# Altium schematic sheet Power.SchDoc: {Наименование}
size 420 x 297 mm; ApprovedBy: {Утвердил}; CheckedBy: {Проверил}; DrawnBy: {Разраб.}; DocumentNumber: НРДЦ.ХХХХХХ.ХХХ 00; SheetNumber: {}; SheetTotal: {}; Scale: {Мш.}; PageSetup: Record=PageOptions|CenterHorizontal=False|CenterVertical=False|PrintScale=0.95|XCorrection=0.00|YCorrection=0.00|PrintKind=1|BorderSize=5000000|LeftOffset=0|BottomOffset=0|Orientation=1|PaperLength=1000|PaperWidth=1000|Scale=100|PaperSource=15|PrintQuality=600|MediaType=1|DitherType=10|PaperKind=A4|PrintScaleMode=1; ProcessInspection: {Т.контр.}; Mass: {М.}; NormInspection: {Н.контр.}; Letter1Column: {}; Letter2Column: {}; Letter3Column: {}; DocumentType: {Документ}; Rule: PcbType=ProtelPcb
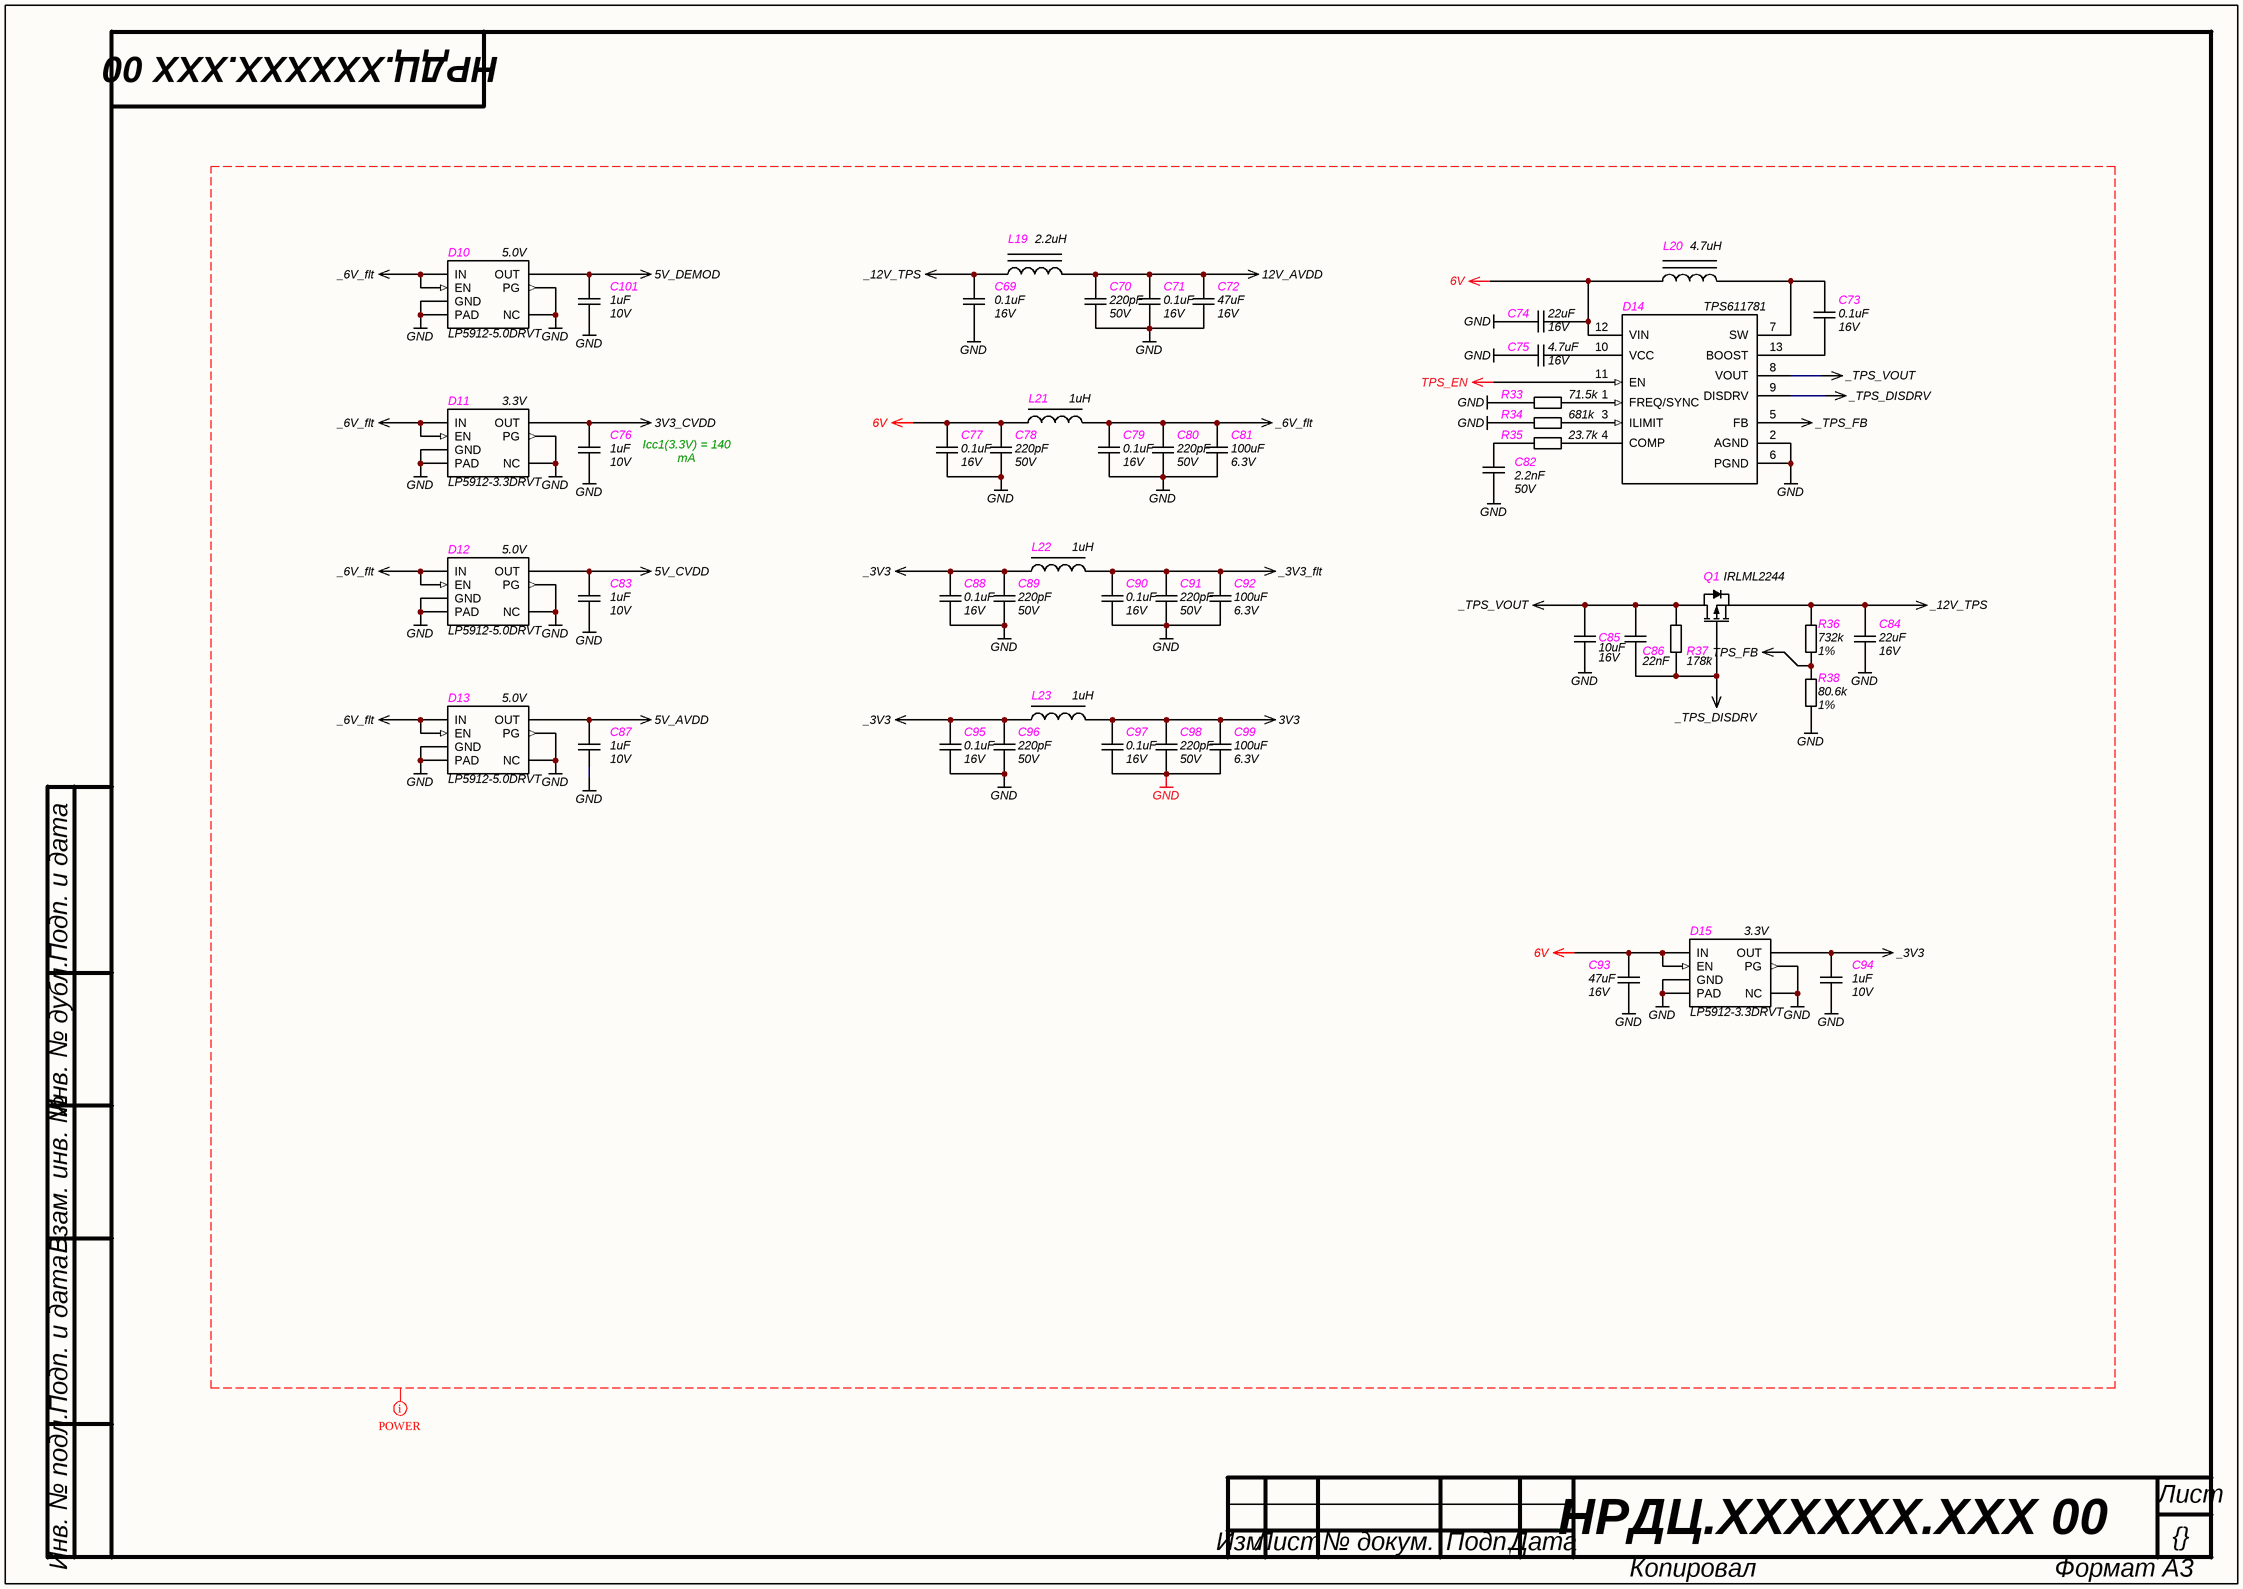
[diagram p0: Power.SchDoc]

## Parts
C69  value 0.1uF  Voltage: 16V  [C0402]  (hidden comment: CAP)
C70  value 220pF  Voltage: 50V  [C0603]  (hidden comment: CAP)
C71  value 0.1uF  Voltage: 16V  [C0402]  (hidden comment: CAP)
C72  value 47uF  Voltage: 16V  [C1210]  (hidden comment: CAP uF)
C73  value 0.1uF  Voltage: 16V  [C0402]  (hidden comment: CAP)
C74  value 22uF  Voltage: 16V  [C0805]  (hidden comment: CAP uF)
C75  value 4.7uF  Voltage: 16V  [C0603]  (hidden comment: CAP)
C76  value 1uF  Voltage: 10V  [C0805]  (hidden comment: CAP)
C77  value 0.1uF  Voltage: 16V  [C0402]  (hidden comment: CAP)
C78  value 220pF  Voltage: 50V  [C0603]  (hidden comment: CAP)
C79  value 0.1uF  Voltage: 16V  [C0402]  (hidden comment: CAP)
C80  value 220pF  Voltage: 50V  [C0603]  (hidden comment: CAP)
C81  value 100uF  Voltage: 6.3V  [C1210]  (hidden comment: CAP uF)
C82  value 2.2nF  Voltage: 50V  [C0603]  (hidden comment: CAP)
C83  value 1uF  Voltage: 10V  [C0805]  (hidden comment: CAP)
C84  value 22uF  Voltage: 16V  [C0805]  (hidden comment: CAP uF)
C85  value 10uF  Voltage: 16V  [C0805]  (hidden comment: CAP uF)
C86  value 22nF  [C0402]  (hidden comment: CAP)
C87  value 1uF  Voltage: 10V  [C0805]  (hidden comment: CAP)
C88  value 0.1uF  Voltage: 16V  [C0402]  (hidden comment: CAP)
C89  value 220pF  Voltage: 50V  [C0603]  (hidden comment: CAP)
C90  value 0.1uF  Voltage: 16V  [C0402]  (hidden comment: CAP)
C91  value 220pF  Voltage: 50V  [C0603]  (hidden comment: CAP)
C92  value 100uF  Voltage: 6.3V  [C1210]  (hidden comment: CAP uF)
C93  value 47uF  Voltage: 16V  [C1210]  (hidden comment: CAP uF)
C94  value 1uF  Voltage: 10V  [C0805]  (hidden comment: CAP)
C95  value 0.1uF  Voltage: 16V  [C0402]  (hidden comment: CAP)
C96  value 220pF  Voltage: 50V  [C0603]  (hidden comment: CAP)
C97  value 0.1uF  Voltage: 16V  [C0402]  (hidden comment: CAP)
C98  value 220pF  Voltage: 50V  [C0603]  (hidden comment: CAP)
C99  value 100uF  Voltage: 6.3V  [C1210]  (hidden comment: CAP uF)
C101  value 1uF  Voltage: 10V  [C0805]  (hidden comment: CAP)
D10  Name: LP5912-5.0DRVT  Voltage: 5.0V  [WSON-6]  (hidden comment: LP5912)
D11  Name: LP5912-3.3DRVT  Voltage: 3.3V  [WSON-6]  (hidden comment: LP5912)
D12  Name: LP5912-5.0DRVT  Voltage: 5.0V  [WSON-6]  (hidden comment: LP5912)
D13  Name: LP5912-5.0DRVT  Voltage: 5.0V  [WSON-6]  (hidden comment: LP5912)
D14  TPS611781  [TPS611781x]
D15  Name: LP5912-3.3DRVT  Voltage: 3.3V  [WSON-6]  (hidden comment: LP5912)
L19  value 2.2uH  [XAL4020]  (hidden comment: Inductor PWR)
L20  value 4.7uH  [XAL4030]  (hidden comment: Inductor PWR)
L21  value 1uH  [L1210_Murata LQH]  (hidden comment: Inductor LF)
L22  value 1uH  [L1210_Murata LQH]  (hidden comment: Inductor LF)
L23  value 1uH  [L1210_Murata LQH]  (hidden comment: Inductor LF)
Q1  IRLML2244  [SOT-23]
R33  value 71.5k  [R0402]  (hidden comment: RES)
R34  value 681k  [R0402]  (hidden comment: RES)
R35  value 23.7k  [R0603]  (hidden comment: RES)
R36  value 732k  Tolerance: 1%  [R0402]  (hidden comment: RES)
R37  value 178k  [R0402]  (hidden comment: RES)
R38  value 80.6k  Tolerance: 1%  [R0402]  (hidden comment: RES)

## Nets
3V3: C97.2 C98.2 C99.2 L23.2
3V3_CVDD: C76.1 D11.1(OUT)
5V_AVDD: C87.1 D13.1(OUT)
5V_CVDD: C83.1 D12.1(OUT)
5V_DEMOD: C101.1 D10.1(OUT)
6V: C74.1 C77.2 C78.2 C93.2 D14.12(VIN) D15.4(EN) D15.6(IN) L20.1 L21.1
12V_AVDD: C70.2 C71.2 C72.2 L19.2
_3V3: C88.2 C89.2 C94.1 C95.2 C96.2 D15.1(OUT) L22.1 L23.1
_3V3_flt: C90.2 C91.2 C92.2 L22.2
_6V_flt: C79.2 C80.2 C81.2 D10.4(EN) D10.6(IN) D11.4(EN) D11.6(IN) D12.4(EN) D12.6(IN) D13.4(EN) D13.6(IN) L21.2
_12V_TPS: C69.2 C84.2 L19.1 Q1.2(S) R36.2
_TPS_DISDRV: C86.2 D14.9(DISDRV) Q1.1(G) R37.1
_TPS_FB: D14.5(FB) R36.1 R38.2
_TPS_VOUT: C85.2 C86.1 D14.8(VOUT) Q1.3(D) R37.2
GND: C69.1 C70.1 C71.1 C72.1 C74.2 C75.2 C76.2 C77.1 C78.1 C79.1 C80.1 C81.1 C82.1 C83.2 C84.1 C85.1 C87.2 C88.1 C89.1 C90.1 C91.1 C92.1 C93.1 C94.2 C95.1 C96.1 C97.1 C98.1 C99.1 C101.2 D10.0(PAD) D10.2(NC) D10.3(PG) D10.5(GND) D11.0(PAD) D11.2(NC) D11.3(PG) D11.5(GND) D12.0(PAD) D12.2(NC) D12.3(PG) D12.5(GND) D13.0(PAD) D13.2(NC) D13.3(PG) D13.5(GND) D14.2(AGND) D14.6(PGND) D15.0(PAD) D15.2(NC) D15.3(PG) D15.5(GND) R33.1 R34.1 R38.1
TPS_EN: D14.11(EN)
NetC73_1: C73.1 D14.13(BOOST)
NetC73_2: C73.2 D14.7(SW) L20.2
NetC75_1: C75.1 D14.10(VCC)
NetC82_2: C82.2 R35.1
NetD14_1: D14.1(FREQ/SYNC) R33.2
NetD14_3: D14.3(ILIMIT) R34.2
NetD14_4: D14.4(COMP) R35.2

## Layout directives
net class POWER: 3V3, 3V3_CVDD, 5V_AVDD, 5V_CVDD, 5V_DEMOD, 6V, 12V_AVDD, _3V3, _3V3_flt, _6V_flt, _12V_TPS, _TPS_DISDRV, _TPS_FB, _TPS_VOUT, GND, TPS_EN

## Notes on the sheet
- (near C76) Icc1(3.3V) = 140 mA
  Icc2(3.3V) = 130 mA
- Подп. и дата
- Инв. № дубл.
- Взам. инв. №
- Инв. № подл.
- Лист
- Изм.
- № докум.
- Подп.
- Дата
- Копировал
- Формат А3

## Library data of the parts
C69 C71 C73 C77 C79 C88 C90 C95 C97 = CAP: SMD Capacitor; Manufacturer: Murata; Material: X7R; Tolerance: 10%; Type: Ceramic Capacitor; P/N: GRM155R71C104KA88J; Supplier 1: Digi-key; Supplier Part Number 1: 490-6328-1-ND; Supplier 2: Mouser; Supplier Part Number 2: 81-GRM155R71C104KA8J; Supplier 3: Farnell; Supplier Part Number 3: *
C70 C78 C80 C89 C91 C96 C98 = CAP: SMD Capacitor; Manufacturer: KEMET; Material: X7R; Tolerance: 10%; Type: Ceramic Capacitor; P/N: C0603C221K5RACAUTO; Supplier 1: Digi-key; Supplier Part Number 1: 399-6869-1-ND; Supplier 2: Mouser; Supplier Part Number 2: 80-C0603C221K5RAUTO; Supplier 3: Farnell; Supplier Part Number 3: *
C72 C93 = CAP uF: SMD Capacitor; Manufacturer: Murata; Material: X6S; Tolerance: 10%; Type: Ceramic Capacitor; P/N: GRM32EC81C476KE15L; Supplier Part Number 1: 490-10531-1-ND; Supplier 2: Mouser; Supplier Part Number 2: 81-GRM32EC81C476KE5L; Supplier 3: Farnell; Supplier Part Number 3: *
  C72: Supplier 1: Digi-Key
  C93: Supplier 1: Digi-key
C74 C84 = CAP uF: SMD Capacitor; Manufacturer: Murata; Material: X5R; Tolerance: ±20%; Type: Ceramic Capacitor; P/N: GRM21BR61C226ME44L; Supplier Part Number 1: 490-10747-1-ND; Supplier 2: Mouser; Supplier Part Number 2: 81-GRM21BR61C226ME4L; Supplier 3: Farnell; Supplier Part Number 3: *
  C74: Supplier 1: Digi-Key
  C84: Supplier 1: Digi-key
C75 = CAP: SMD Capacitor; Manufacturer: Murata; Material: X5R; Tolerance: 10%; Type: Ceramic Capacitor; P/N: GRM188R61C475KAAJD; Supplier 1: Digi-key; Supplier Part Number 1: 490-10481-1-ND; Supplier 2: Mouser; Supplier Part Number 2: 81-GRM188R61C475KAJD; Supplier 3: Farnell; Supplier Part Number 3: *
C76 C83 C87 C94 C101 = CAP: SMD Capacitor; Manufacturer: Murata; Material: X7R; Tolerance: 10%; Type: Ceramic Capacitor; P/N: GRM21BR71A105KA01K; Supplier 1: Digi-key; Supplier Part Number 1: 490-11595-1-ND; Supplier 2: Mouser; Supplier Part Number 2: 81-GRM40X105K10K; Supplier 3: Farnell; Supplier Part Number 3: *
C81 C92 C99 = CAP uF: SMD Capacitor; Manufacturer: Murata; Material: X5R; Tolerance: 20%; Type: Ceramic Capacitor; P/N: GRM32ER60J107ME20L; Supplier 1: Digi-key; Supplier Part Number 1: 490-3390-1-ND; Supplier 2: Mouser; Supplier Part Number 2: 81-GRM32ER60J107ME20; Supplier 3: Farnell; Supplier Part Number 3: *
C82 = CAP: SMD Capacitor; Manufacturer: Murata; Material: NP0; Tolerance: ±5%; Type: Ceramic Capacitor; P/N: GRM1885C1H222JA01D; Supplier 1: Digi-key; Supplier Part Number 1: 490-1459-1-ND; Supplier 2: Mouser; Supplier Part Number 2: 81-GRM1885C1H222JA01; Supplier 3: Farnell; Supplier Part Number 3: *
C85 = CAP uF: SMD Capacitor; Manufacturer: Murata; Material: X5R; Tolerance: ±10%; Type: Ceramic Capacitor; P/N: GRM21BR61C106KE15K; Supplier 1: Digi-key; Supplier Part Number 1: 490-6473-1-ND; Supplier 2: Mouser; Supplier Part Number 2: 81-GRM21BR61C106KE5K; Supplier 3: Farnell; Supplier Part Number 3: *
C86 = CAP: SMD Capacitor; Manufacturer: Murata; Material: X7R; Tolerance: 10%; Voltage: 50V; Type: Ceramic Capacitor; P/N: GCM155R71H223KA55D; Supplier 1: Digi-key; Supplier Part Number 1: 490-4763-1-ND; Supplier 2: Mouser; Supplier Part Number 2: 81-GCM155R71H223KA5D; Supplier 3: Farnell; Supplier Part Number 3: *
D10-D13 D15 = LP5912: LP5912 500-mA Low-Noise, Low-IQ LDO; Manufacturer: Texas Instruments; Type: Low-Noise LDO; Current: 500mA; Package: WSON; Temperature Range: –40°C to 125°C; Supplier 1: Digi-key; Supplier 2: Mouser; Supplier 3: Farnell; Supplier Part Number 3: *
  D10 D12 D13: P/N: LP5912-5.0DRVT; Supplier 4: Arrow Electronics; Supplier Part Number 4: LP5912-5.0DRVT; Supplier Part Number 1: 296-52224-1-ND; Supplier Part Number 2: 595-LP5912-5.0DRVT
  D11 D15: P/N: LP5912-3.3DRVT; Supplier Part Number 1: 296-44153-2-ND; Supplier Part Number 2: 595-LP5912-3.3DRVT
D14 = TPS611781: 10-A Fully-Integrated Synchronous Boost with Load Disconnect Control; Manufacturer: Texas Instruments; Voltage: 4.5 V to 20 V; P/N: TPS611781RNW; Current: 10 A; Name: TPS611781; Package: 13-VQFN-HR (3.5x3.0); Temperature Range: –40°C to 125°C; Type: Synchronous Boost; Supplier 1: Digi-Key; Supplier Part Number 1: 296-46568-1-ND; Supplier 2: Mouser; Supplier Part Number 2: 595-TPS611781RNWT; Supplier 3: Farnell; Supplier Part Number 3: *
L19 = Inductor PWR: Magnetic-Core Inductor; Manufacturer: Coilcraft; Name: XEL4020-222MEC; Current: 5.9A; Tolerance: ±30%; Temperature Range: -40ºC to 125ºC; P/N: XEL4020-222MEC; Supplier 2: Mouser; Supplier Part Number 2: 994-XEL4020-222MEC; Supplier 3: Farnell; Supplier Part Number 3: 2836818; Supplier 1: Digi-key; Supplier Part Number 1: *
L20 = Inductor PWR: Magnetic-Core Inductor; Manufacturer: Coilcraft; Name: XEL4030-472MEC; Current: 5A; Tolerance: ±30%; Temperature Range: -40ºC to 125ºC; P/N: XEL4030-472MEC; Supplier 1: Digi-key; Supplier Part Number 1: *; Supplier 2: Mouser; Supplier Part Number 2: 994-XEL4030-472MEC; Supplier 3: Farnell; Supplier Part Number 3: 2836831
L21-L23 = Inductor LF: Inductor Power Lines; Manufacturer: Murata; Name: LQH32PN1R0NNC; Current: 2500mA; Tolerance: 5%; Frequency: 100MHz; Temperature Range: -25ºC to 85ºC; Series: LQH; P/N: LQH32PN1R0NNC; Supplier 1: Digi-key; Supplier Part Number 1: 490-12035-1-ND; Supplier 2: Mouser; Supplier Part Number 2: 81-LQH32PN1R0NNCL; Supplier 3: Farnell; Supplier Part Number 3: *
Q1 = IRLML2244: P-Channel MOSFET; Current: 4.3A; Channel Resistance: 54 mΩ; Power Dissipation: 1.3W; Voltage: -20V; P/N: IRLML2244TRPBF; Name: IRLML2244; Package: SOT-23; Type: P-Channel Mosfet; Value: IRLML2244; Supplier 1: Digi-key; Supplier Part Number 1: IRLML2244TRPBFCT-ND; Supplier 2: Mouser; Supplier Part Number 2: 942-IRLML2244TRPBF; Supplier 3: Farnell; Supplier Part Number 3: 2468051
R33 = RES: SMD Resistor; Manufacturer: Panasonic Electronic Components; Name: Chip SMD Resistor; Power: 0.063 Wt; Tolerance: 1%; P/N: ERJ-2RKF7152X; Temperature Range: -55…155°C; Supplier 1: Digi-key; Supplier Part Number 1: P71.5KLCT-ND; Supplier 2: Mouser; Supplier Part Number 2: 667-ERJ-2RKF7152X; Supplier 3: Farnell; Supplier Part Number 3: *
R34 = RES: SMD Resistor; Manufacturer: Panasonic Electronic Components; Name: Chip SMD Resistor; Power: 0.063 Wt; Tolerance: 1%; P/N: ERJ-2RKF6813X; Temperature Range: -55…155°C; Supplier 1: Digi-key; Supplier Part Number 1: P681KLCT-ND; Supplier 2: Mouser; Supplier Part Number 2: 667-ERJ-2RKF6813X; Supplier 3: Farnell; Supplier Part Number 3: *
R35 = RES: SMD Resistor; Manufacturer: Panasonic Electronic Components; Name: Chip SMD Resistor; Power: 0.1 Wt; Tolerance: 1%; P/N: ERJ-3EKF2372V; Temperature Range: -55…155°C; Supplier 1: Digi-key; Supplier Part Number 1: P23.7KHCT-ND; Supplier 2: Mouser; Supplier Part Number 2: 667-ERJ-3EKF2372V; Supplier 3: Farnell; Supplier Part Number 3: *
R36 = RES: SMD Resistor; Manufacturer: Panasonic Electronic Components; Name: Chip SMD Resistor; Power: 0.063 Wt; P/N: ERJ-2RKF7323X; Temperature Range: -55…155°C; Supplier 1: Digi-key; Supplier Part Number 1: P732KLCT-ND; Supplier 2: Mouser; Supplier Part Number 2: 667-ERJ-2RKF7323X; Supplier 3: Farnell; Supplier Part Number 3: *
R37 = RES: SMD Resistor; Manufacturer: Panasonic Electronic Components; Name: Chip SMD Resistor; Power: 0.063 Wt; Tolerance: 1%; P/N: ERJ-2RKF1783X; Temperature Range: -55…155°C; Supplier 1: Digi-key; Supplier Part Number 1: P178KLCT-ND; Supplier 2: Mouser; Supplier Part Number 2: 667-ERJ-2RKF1783X; Supplier 3: Farnell; Supplier Part Number 3: *
R38 = RES: SMD Resistor; Manufacturer: Panasonic Electronic Components; Name: Chip SMD Resistor; Power: 0.063 Wt; P/N: ERJ-2RKF8062X; Temperature Range: -55…155°C; Supplier 1: Digi-key; Supplier Part Number 1: P80.6KLCT-ND; Supplier 2: Mouser; Supplier Part Number 2: 667-ERJ-2RKF8062X; Supplier 3: Farnell; Supplier Part Number 3: *